# EAGLE design dip (EAGLE 6.3)
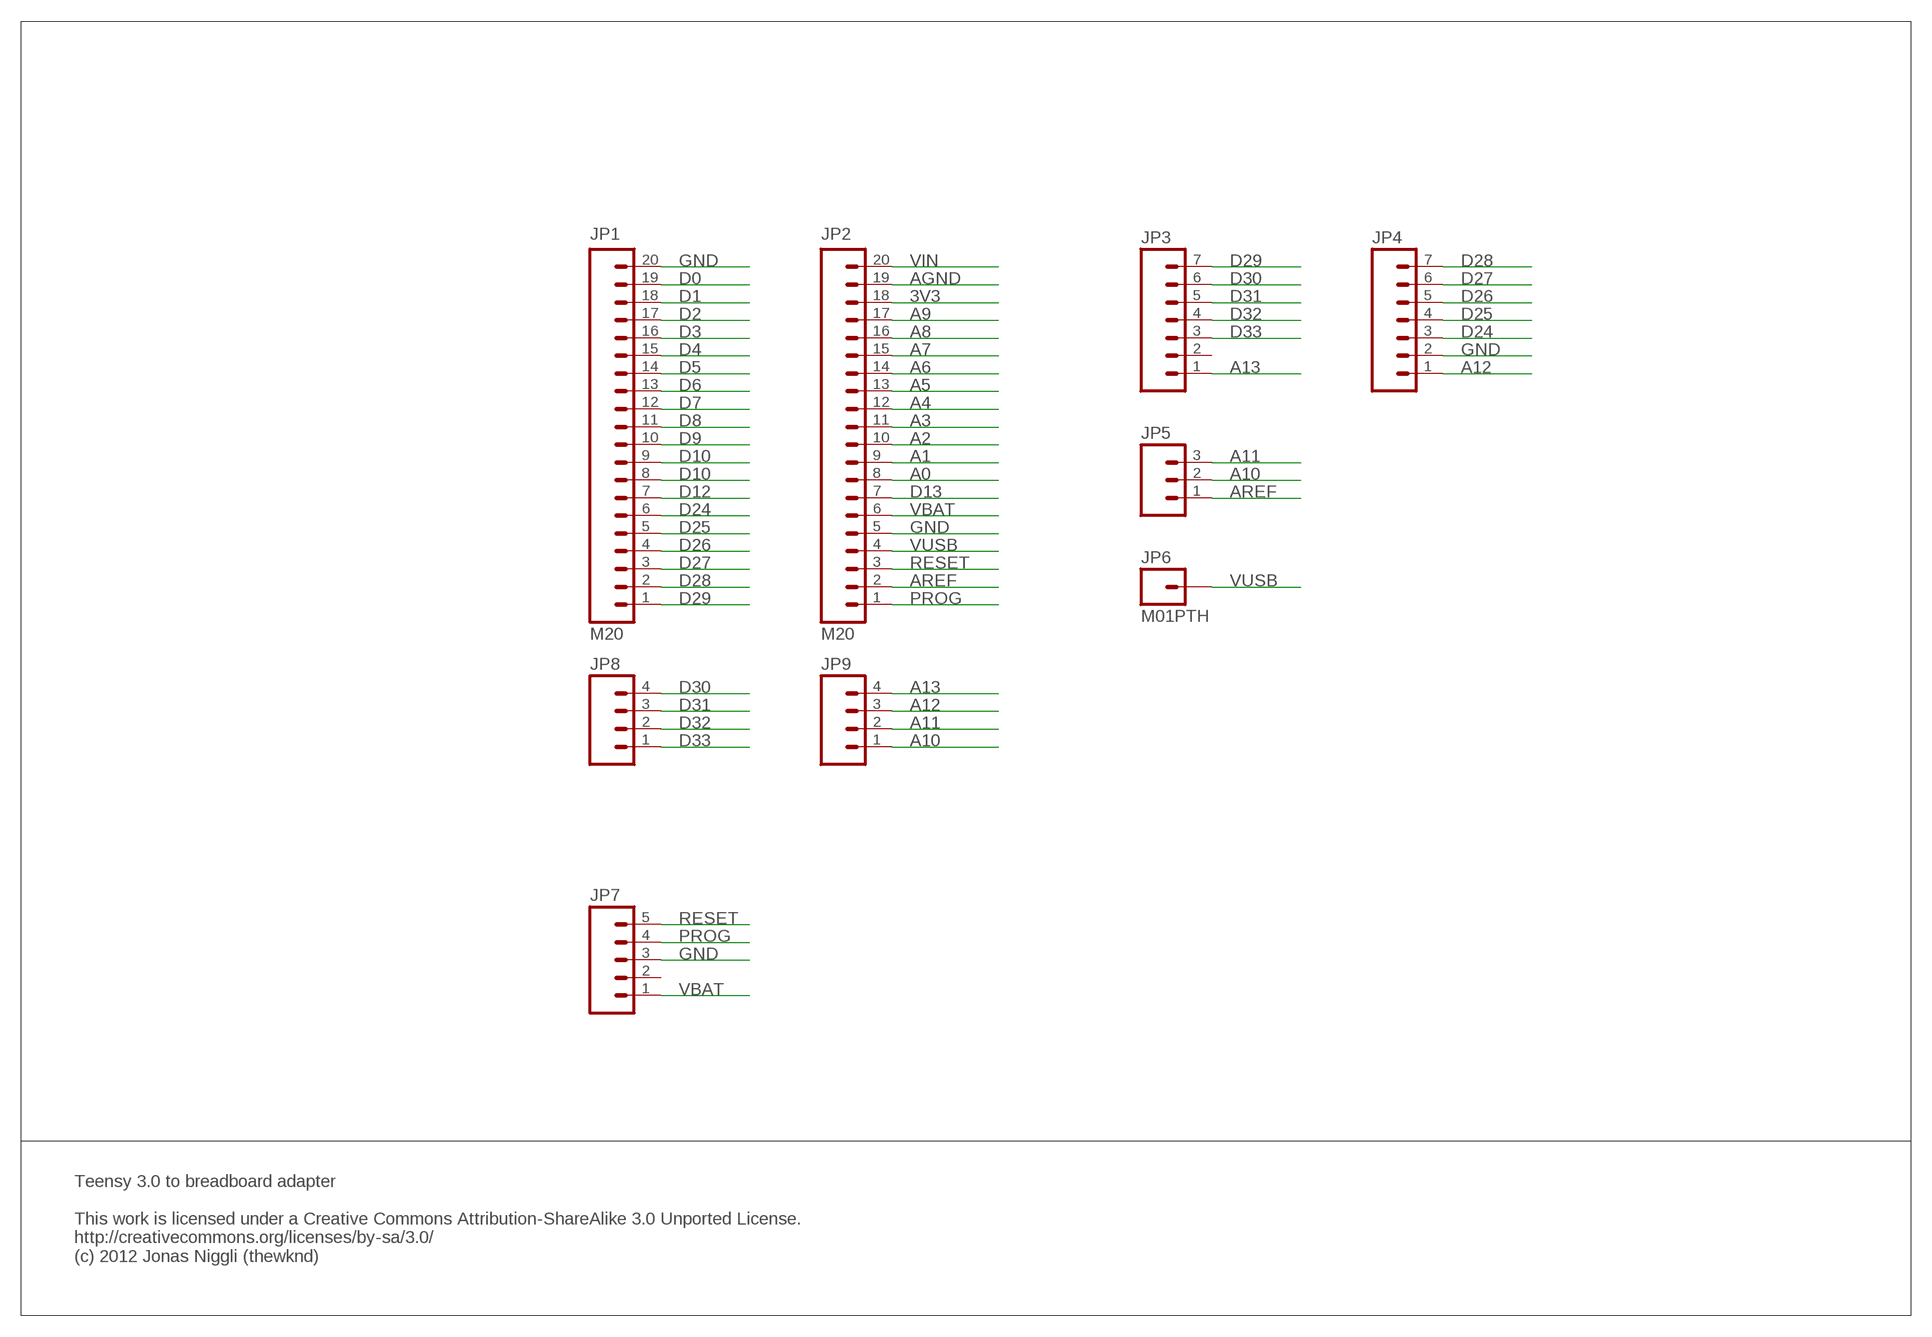
[diagram p0: schematic, sheet 1]

## Parts
JP1  M20  [1X20]
JP2  M20  [1X20]
JP3  M07  [1X07]
JP4  M07  [1X07]
JP5  M03PTH  [1X03]
JP6  M01PTH  [1X01]
JP7  M05PTH  [1X05]
JP8  M04PTH  [1X04]
JP9  M04PTH  [1X04]

## Nets
3V3: JP2.18
A0: JP2.8
A1: JP2.9
A2: JP2.10
A3: JP2.11
A4: JP2.12
A5: JP2.13
A6: JP2.14
A7: JP2.15
A8: JP2.16
A9: JP2.17
A10: JP5.2 JP9.1
A11: JP5.3 JP9.2
A12: JP4.1 JP9.3
A13: JP3.1 JP9.4
AGND: JP2.19
AREF: JP2.2 JP5.1
D0: JP1.19
D1: JP1.18
D2: JP1.17
D3: JP1.16
D4: JP1.15
D5: JP1.14
D6: JP1.13
D7: JP1.12
D8: JP1.11
D9: JP1.10
D10: JP1.9
D11: JP1.8
D12: JP1.7
D13: JP2.7
D24: JP1.6 JP4.3
D25: JP1.5 JP4.4
D26: JP1.4 JP4.5
D27: JP1.3 JP4.6
D28: JP1.2 JP4.7
D29: JP1.1 JP3.7
D30: JP3.6 JP8.4
D31: JP3.5 JP8.3
D32: JP3.4 JP8.2
D33: JP3.3 JP8.1
GND: JP1.20 JP2.5 JP4.2 JP7.3
PROG: JP2.1 JP7.4
RESET: JP2.3 JP7.5
VBAT: JP2.6 JP7.1
VIN: JP2.20
VUSB: JP2.4 JP6.1
Unconnected: JP3.2 JP7.2

## Notes on the sheet
- Teensy 3.0 to breadboard adapter
  
  This work is licensed under a Creative Commons Attribution-ShareAlike 3.0 Unported License.
  http://creativecommons.org/licenses/by-sa/3.0/
  (c) 2012 Jonas Niggli (thewknd)

## Library data of the parts
JP1 JP2 = SparkFun-Connectors:M20: 1x20 .1" header This is just like the LOCK variant in that the holes are staggared by 5 mil, but except for the last two holes. They are not altered from the "standard" footprint layout. This is used for a special purpose on the layout of our Graphic LCD Backpack. Make sure you want to use this device before selecting it for you project!
JP3 JP4 = SparkFun-Connectors:M07: Header 7 Standard 7-pin 0.1" header. Use with straight break away headers (SKU : PRT-00116), right angle break away headers (PRT-00553), swiss pins (PRT-00743), machine pins (PRT-00117), and female headers (PRT-00115). NOTES ON THE VARIANTS LOCK and LOCK_LONGPADS... This footprint was designed to help hold the alignment of a through-hole component (i.e. 7-pin header) while soldering it into place. You may notice that each hole has been shifted either up or down by 0.005 of an inch from it's more standard position (which is usually a perfectly straight line). This slight alteration caused the pins (the squares in the middle) to touch the edges of the holes. Because they are alternating, it causes a "brace" to hold the header in place. 0.005 has proven to be the perfect amount of "off-center" position when using our standard breakaway headers. Although looks a little odd when you look at the bare footprint, once you have a header in there, the alteration is very hard to notice. Also, if you push a header all the way into place, it is covered up entirely on the bottom side. This idea of altering the position of holes to aid alignment will be further integrated into the Sparkfun Library for other footprints. It can help hold any component with 3 or more connection pins.
JP5 = SparkFun-Connectors:M03: Header 3 Standard 3-pin 0.1" header. Use with straight break away headers (SKU : PRT-00116), right angle break away headers (PRT-00553), swiss pins (PRT-00743), machine pins (PRT-00117), and female headers (PRT-00115). Molex polarized connector foot print use with SKU : PRT-08232 with associated crimp pins and housings.
JP6 = SparkFun-Connectors:M01: Header 1 Standard 1-pin 0.1" header. Use with straight break away headers (SKU : PRT-00116), right angle break away headers (PRT-00553), swiss pins (PRT-00743), machine pins (PRT-00117), and female headers (PRT-00115).
JP7 = SparkFun-Connectors:M05: Header 5 Standard 5-pin 0.1" header. Use with straight break away headers (SKU : PRT-00116), right angle break away headers (PRT-00553), swiss pins (PRT-00743), machine pins (PRT-00117), and female headers (PRT-00115). Molex polarized connector foot print use with SKU : PRT-08230 with associated crimp pins and housings.
JP8 JP9 = SparkFun-Connectors:M04: Header 4 Standard 4-pin 0.1" header. Use with straight break away headers (SKU : PRT-00116), right angle break away headers (PRT-00553), swiss pins (PRT-00743), machine pins (PRT-00117), and female headers (PRT-00115). Molex polarized connector foot print use with SKU : PRT-08231 with associated crimp pins and housings. 1MM SMD Version SKU: PRT-10208

## Board
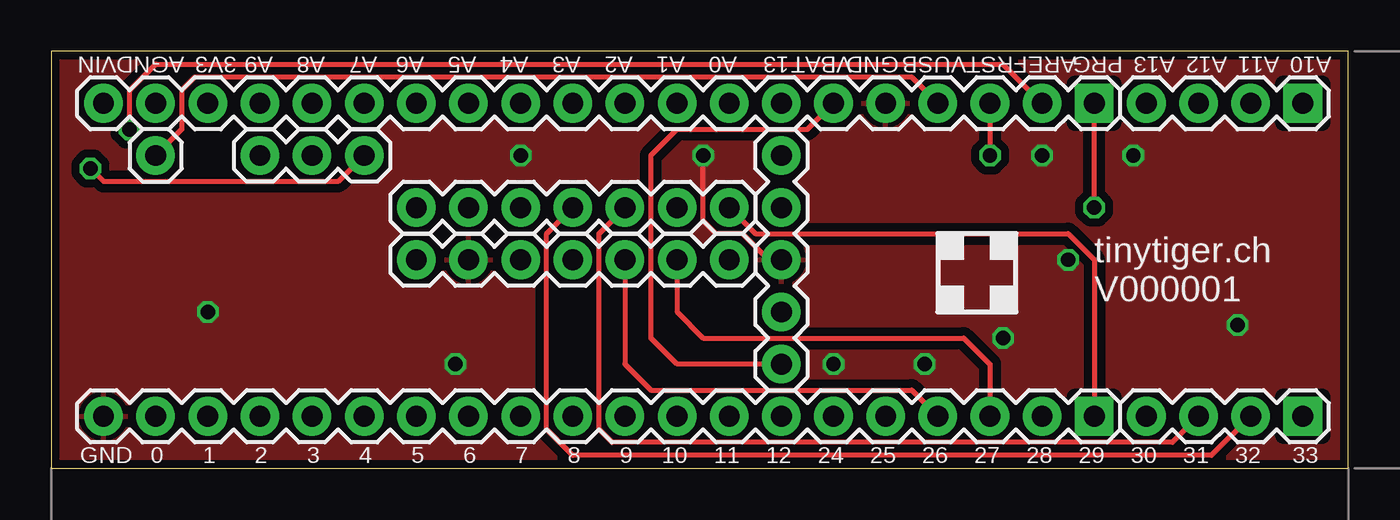
[diagram p1: board, top side]
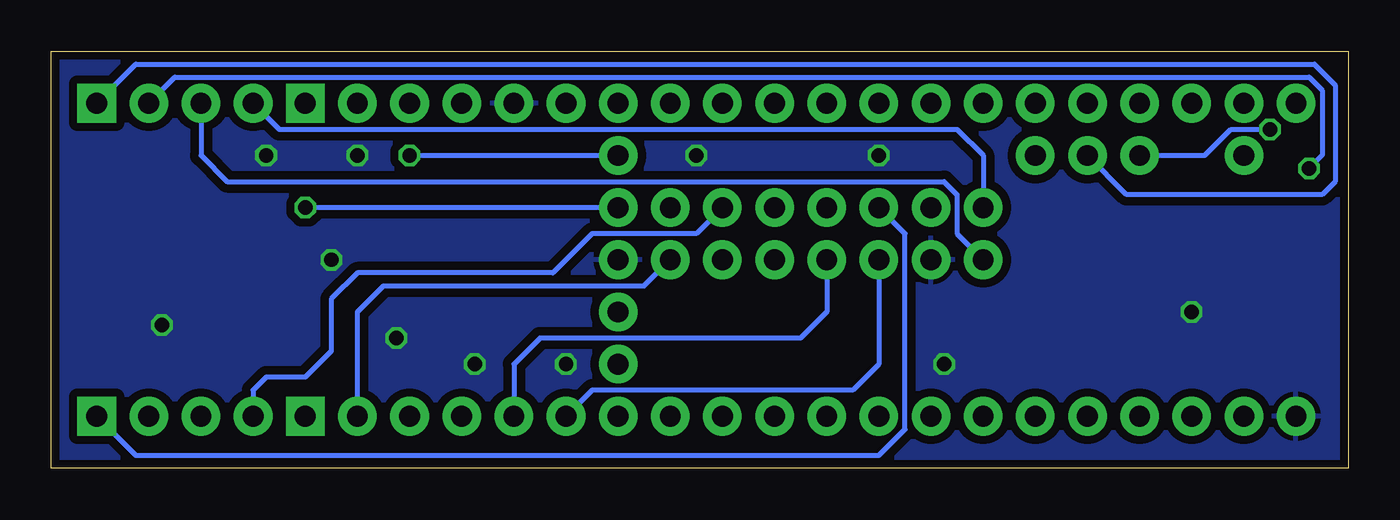
[diagram p2: board, bottom side, seen from below]

Size 63.17 x 20.31 mm. Coordinates in mm from the lower left corner, seen from the top.
Outline: 63.17,0 63.17,20.31 0,20.31 0,0 63.17,0
Copper layers (1*16): Top 0.035mm / dielectric 1.5mm / Bottom 0.035mm
Design rules "ITEADstudio_DRC": minimum track width 6mil, minimum drill 12mil, track to track 6mil, track to pad 6mil, pad to pad 6mil, via to via 6mil, smd to smd 0mil, copper to edge 10mil, drill to drill 10mil, minimum pad ring 10mil, minimum via ring 6mil, stop-mask expansion 2mil, vias tented up to drill 100mil, thermal gap 10mil

### Footprints (pad centres in the part's own frame; a part is rotated, then mirrored left to right if it is on the bottom)
1X20 = drill 1.016 pad 1.88 square: 1 0,0 | drill 1.016 pad 1.88: 2 2.54,0; 3 5.08,0; 4 7.62,0; 5 10.16,0; 6 12.7,0; 7 15.24,0; 8 17.78,0; 9 20.32,0; 10 22.86,0; 11 25.4,0; 12 27.94,0; 13 30.48,0; 14 33.02,0; 15 35.56,0; 16 38.1,0; 17 40.64,0; 18 43.18,0; 19 45.72,0; 20 48.26,0
1X07 = drill 1.016 pad 1.88: 1 0,0; 2 2.54,0; 3 5.08,0; 4 7.62,0; 5 10.16,0; 6 12.7,0; 7 15.24,0
1X03 = drill 1.016 pad 1.88: 1 0,0; 2 2.54,0; 3 5.08,0
1X01 = drill 1.016 pad 1.88: 1 0,0
1X05 = drill 1.016 pad 1.88: 1 0,0; 2 2.54,0; 3 5.08,0; 4 7.62,0; 5 10.16,0
1X04 = drill 1.016 pad 1.88 square: 1 0,0 | drill 1.016 pad 1.88: 2 2.54,0; 3 5.08,0; 4 7.62,0

### Placement (x,y rotation side)
JP1  50.8,2.54 180 top
JP2  50.8,17.78 180 top
JP3  17.78,12.7 0 top
JP4  17.78,10.16 0 top
JP5  10.16,15.24 0 top
JP6  5.08,15.24 0 top
JP7  35.56,5.08 90 top
JP8  60.96,2.54 180 top
JP9  60.96,17.78 180 top

### Tracks (layer width: path | path; a pad name or v marks a point on that pad's centre or on a via)
A10
  Bottom 0.254: JP9.1 59.05,19.68 1.65,19.68 0.64,18.67 0.64,13.97 1.27,13.34 10.79,13.34 JP5.2
A11  (via drill 0.7 pad 0.3)
  Top 0.254: JP5.3 13.97,13.97 2.54,13.97 v1.91,14.61
  Bottom 0.254: JP9.2 57.15,19.05 1.91,19.05 1.27,18.41 1.27,15.24 v1.91,14.61
A12
  Bottom 0.254: JP4.1 19.05,11.43 19.05,13.34 19.68,13.97 54.61,13.97 55.88,15.24 JP9.3
A13
  Bottom 0.254: JP9.4 52.07,16.51 19.05,16.51 17.78,15.24 JP3.1
AREF  (via drill 0.7 pad 0.3)
  Top 0.254: v3.81,16.51 3.81,18.41 5.08,19.68 46.35,19.68 JP2.2
  Bottom 0.254: JP5.1 6.99,15.24 5.71,16.51 v3.81,16.51
D24
  Bottom 0.254: JP4.3 22.86,5.08 24.13,3.81 36.83,3.81 JP1.6
D25
  Bottom 0.254: JP4.4 25.4,7.62 26.67,6.35 39.37,6.35 40.64,5.08 JP1.5
D26
  Top 0.254: JP4.5 27.94,5.08 29.21,3.81 41.91,3.81 JP1.4
D27
  Top 0.254: JP4.6 30.48,7.62 31.75,6.35 44.45,6.35 45.72,5.08 JP1.3
D28
  Bottom 0.254: JP1.2 48.26,7.62 46.99,8.89 34.29,8.89 JP4.7
D29
  Top 0.254: JP3.7 34.29,11.43 49.53,11.43 50.8,10.16 JP1.1
D30
  Bottom 0.254: JP3.6 31.75,11.43 36.83,11.43 38.73,9.53 48.26,9.53 49.53,8.26 49.53,5.71 50.8,4.45 52.7,4.45 53.34,3.81 JP8.4
D31
  Top 0.254: JP8.3 54.61,1.27 27.3,1.27 26.67,1.91 26.67,11.43 JP3.5
D32
  Top 0.254: JP8.2 56.52,0.64 25.4,0.64 24.13,1.91 24.13,11.43 JP3.4
D33
  Bottom 0.254: JP8.1 59.05,0.64 22.86,0.64 21.59,1.91 21.59,11.43 JP3.3
GND  (via drill 0.7 pad 0.3)
  Top 0.254: JP7.3 34.92,10.16 33.66,11.43 32.38,11.43 31.75,12.06 v31.75,15.24
  other vias: 7.62,7.62 19.68,5.08 38.1,5.08 42.55,5.08 46.35,6.35 49.53,10.16 48.26,15.24 52.7,15.24 57.78,6.99 22.86,15.24
  pour Top (isolate 0.406, rank 2): 0,0 63.5,0 63.5,20.32 0,20.32
  pour Bottom (isolate 0.406, rank 2): 0,20.32 0,0 63.5,0 63.5,20.32
PROG  (via drill 0.7 pad 0.3)
  Top 0.254: v50.8,12.7 JP2.1
  Bottom 0.254: JP7.4 v50.8,12.7
RESET  (via drill 0.7 pad 0.3)
  Top 0.254: JP2.3 v45.72,15.24
  Bottom 0.254: v45.72,15.24 JP7.5
VBAT
  Top 0.254: JP7.1 30.48,5.08 29.21,6.35 29.21,15.24 30.48,16.51 36.83,16.51 JP2.6
VUSB
  Top 0.254: JP2.4 41.91,19.05 6.99,19.05 6.35,18.41 6.35,16.51 JP6.1

### Text on the board
tNames: VIN | AGND | 3V3 | A9 | A8 | A7 | A6 | A5 | A4 | A3 | A2 | A1 | A0 | 13 | VBAT | GND | VUSB | RST | AREF | PRG | A13 | A12 | A11 | A10 | tinytiger.ch / V000001 | GND | 0 | 1 | 2 | 3 | 4 | 5 | 6 | 7 | 8 | 9 | 10 | 11 | 12 | 24 | 25 | 26 | 27 | 28 | 29 | 30 | 31 | 32 | 33
tDocu: Teensy 3.0 to breadboard adapter / / This work is licensed under a Creative Commons Attribution-ShareAlike 3.0 Unported License. / http://creativecommons.org/licenses/by-sa/3.0/ / (c) 2012 Jonas Niggli (thewknd)